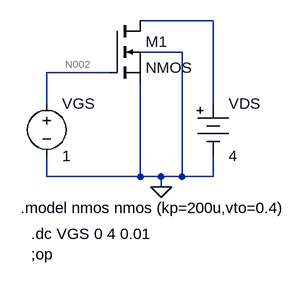
[diagram p0: schematic Draft6.asc]
Draft6.asc, the LTspice schematic file:
Version 4
SHEET 1 880 680
WIRE 400 208 288 208
WIRE 352 256 288 256
WIRE 240 288 144 288
WIRE 144 336 144 288
WIRE 400 336 400 208
WIRE 144 448 144 416
WIRE 288 448 288 304
WIRE 288 448 144 448
WIRE 320 448 288 448
WIRE 352 448 352 256
WIRE 352 448 320 448
WIRE 400 448 400 416
WIRE 400 448 352 448
WIRE 320 464 320 448
FLAG 320 464 0
SYMBOL nmos 240 208 R0
SYMATTR InstName M1
SYMBOL voltage 144 320 R0
SYMATTR InstName VGS
SYMATTR Value 1
SYMBOL Misc\\battery 400 320 R0
SYMATTR InstName VDS
SYMATTR Value 4
TEXT 104 496 Left 2 !.model nmos nmos (kp=200u,vto=0.4)
TEXT 120 568 Left 2 !;op
TEXT 120 536 Left 2 !.dc VGS 0 4 0.01

The netlist it stands for:
* Draft6.asc
M1 N001 N002 0 0 NMOS
VGS N002 0 1
VDS N001 0 4
.model NMOS NMOS
.model PMOS PMOS
.lib standard.mos
.model nmos nmos (kp=200u,vto=0.4)
;op
.dc VGS 0 4 0.01
.backanno
.end

* Results of the author's LTspice run, read from the files saved beside the schematic
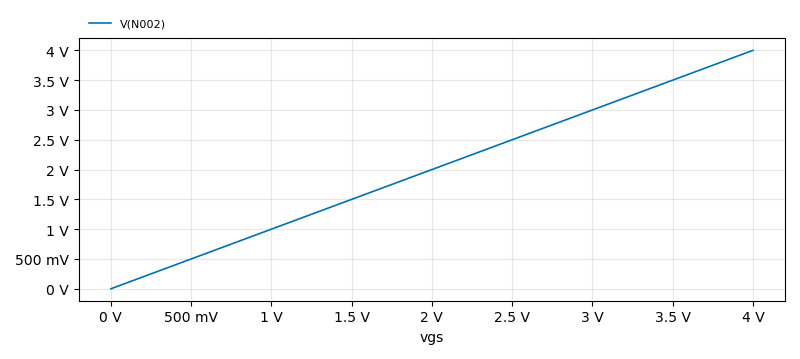
[diagram p1: DC transfer characteristic of Draft6.asc, plotted from the saved traces]
* DC transfer characteristic, 1 run:
*   V(N002): 0 V at vgs=0 V, 4 V at vgs=4 V, min 0 V, max 4 V